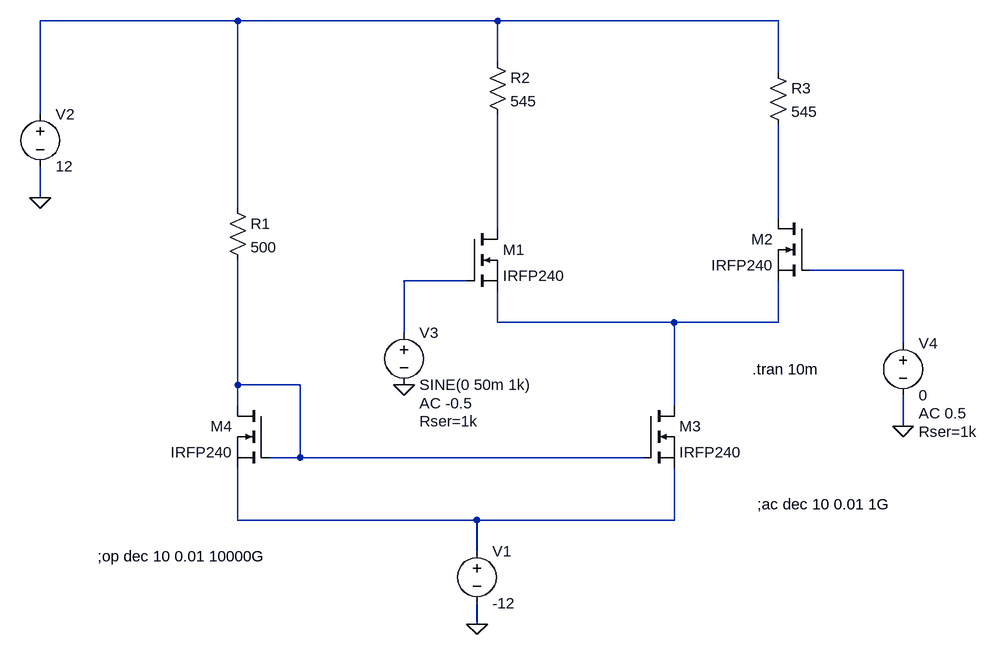
[diagram p0: schematic Differential Amplifier.asc]
Differential Amplifier.asc, the LTspice schematic file:
Version 4
SHEET 1 880 680
WIRE -384 -352 -688 -352
WIRE 16 -352 -384 -352
WIRE 448 -352 16 -352
WIRE 16 -288 16 -352
WIRE 448 -272 448 -352
WIRE -688 -208 -688 -352
WIRE -688 -80 -688 -128
WIRE -384 -64 -384 -352
WIRE 448 -48 448 -192
WIRE 16 -32 16 -208
WIRE 640 32 496 32
WIRE -32 48 -128 48
WIRE 16 112 16 64
WIRE 288 112 16 112
WIRE 448 112 448 48
WIRE 448 112 288 112
WIRE -128 128 -128 48
WIRE 640 144 640 32
WIRE -384 208 -384 16
WIRE -288 208 -384 208
WIRE -384 240 -384 208
WIRE 288 240 288 112
WIRE 640 272 640 224
WIRE -288 320 -288 208
WIRE -288 320 -336 320
WIRE 240 320 -288 320
WIRE -384 416 -384 336
WIRE -16 416 -384 416
WIRE 288 416 288 336
WIRE 288 416 -16 416
WIRE -16 464 -16 416
WIRE -16 576 -16 544
FLAG 640 272 0
FLAG -688 -80 0
FLAG -16 576 0
FLAG -128 208 0
SYMBOL voltage -688 -224 R0
WINDOW 123 0 0 Left 0
WINDOW 39 0 0 Left 0
SYMATTR InstName V2
SYMATTR Value 12
SYMBOL res -400 -80 R0
SYMATTR InstName R1
SYMATTR Value 500
SYMBOL res 0 -304 R0
SYMATTR InstName R2
SYMATTR Value 545
SYMBOL res 432 -288 R0
SYMATTR InstName R3
SYMATTR Value 545
SYMBOL voltage -128 112 R0
WINDOW 123 24 124 Left 2
WINDOW 39 24 152 Left 2
SYMATTR Value2 AC -0.5
SYMATTR SpiceLine Rser=1k
SYMATTR InstName V3
SYMATTR Value SINE(0 50m 1k)
SYMBOL voltage 640 128 R0
WINDOW 123 24 124 Left 2
WINDOW 39 24 152 Left 2
SYMATTR Value2 AC 0.5
SYMATTR SpiceLine Rser=1k
SYMATTR InstName V4
SYMATTR Value 0
SYMBOL voltage -16 448 R0
SYMATTR InstName V1
SYMATTR Value -12
SYMBOL nmos 240 240 R0
SYMATTR InstName M3
SYMATTR Value IRFP240
SYMBOL nmos -32 -32 R0
SYMATTR InstName M1
SYMATTR Value IRFP240
SYMBOL nmos 496 -48 M0
SYMATTR InstName M2
SYMATTR Value IRFP240
SYMBOL nmos -336 240 M0
SYMATTR InstName M4
SYMATTR Value IRFP240
TEXT -600 472 Left 2 !;op dec 10 0.01 10000G
TEXT 408 184 Left 2 !.tran 10m
TEXT 416 392 Left 2 !;ac dec 10 0.01 1G

The netlist it stands for:
* Differential Amplifier.asc
V2 N001 0 12
R1 N001 N007 500
R2 N001 N003 545
R3 N001 N002 545
V3 N005 0 SINE(0 50m 1k) AC -0.5 Rser=1k
V4 N004 0 0 AC 0.5 Rser=1k
V1 N008 0 -12
M3 N006 N007 N008 N008 IRFP240
M1 N003 N005 N006 N006 IRFP240
M2 N002 N004 N006 N006 IRFP240
M4 N007 N007 N008 N008 IRFP240
.model NMOS NMOS
.model PMOS PMOS
.lib standard.mos
;op dec 10 0.01 10000G
.tran 10m
;ac dec 10 0.01 1G
.backanno
.end